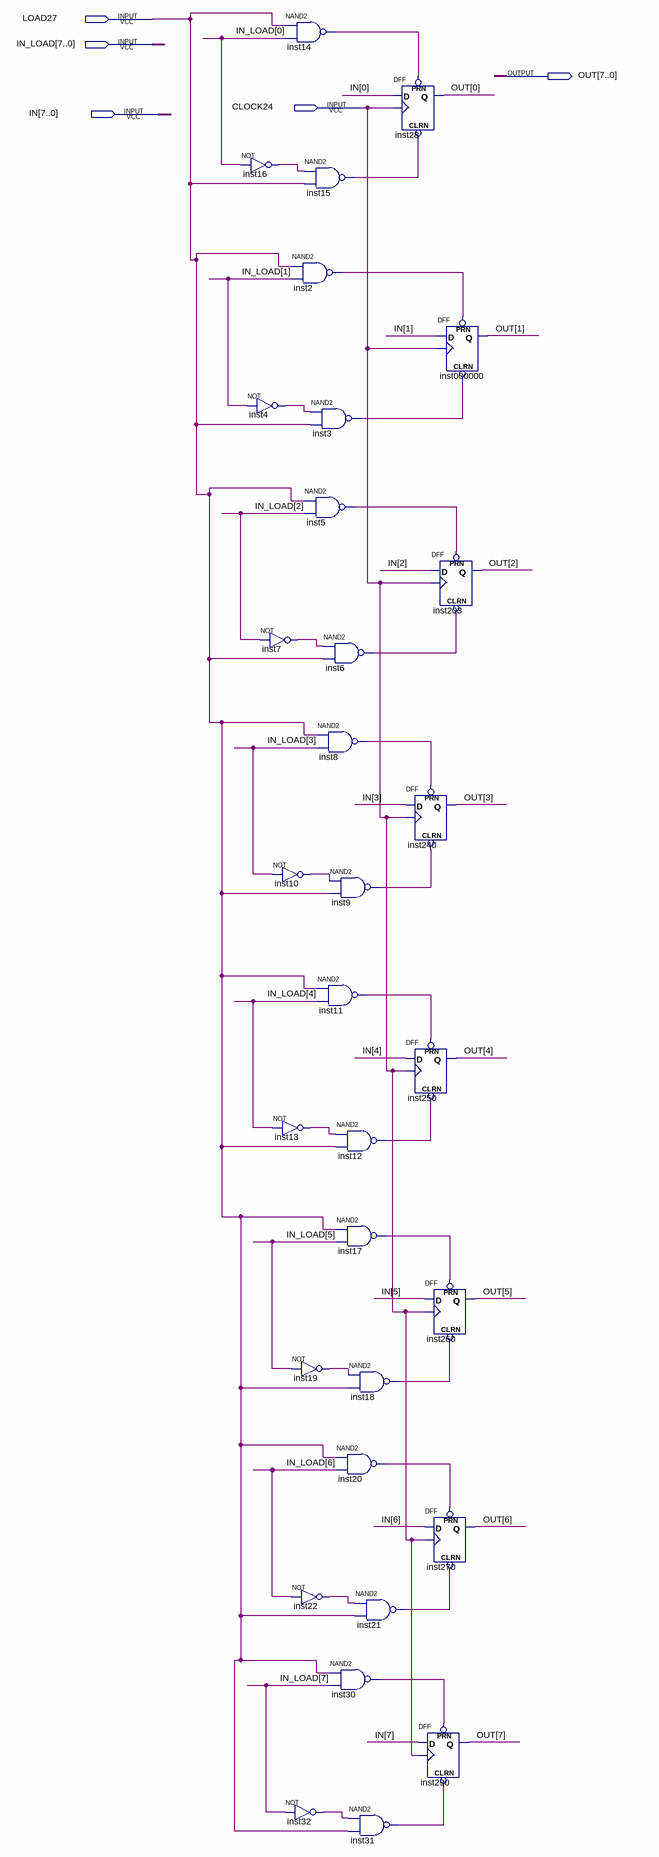
[diagram p0: schematic sheet]
// Quartus schematic REGISTER_8bit.bdf as structural Verilog: 32 symbols, 5 pins
module REGISTER_8bit (
  input  LOAD27,
  input  [7:0] IN_LOAD,
  input  CLOCK24,
  input  [7:0] IN,
  output [7:0] OUT
);

  wire inst2_out, inst3_out, inst4_out, inst5_out, inst6_out, inst7_out, inst8_out, inst9_out, inst10_out,
       inst11_out, inst12_out, inst13_out, inst14_out, inst15_out, inst16_out, inst17_out, inst18_out,
       inst19_out, inst20_out, inst21_out, inst22_out, inst30_out, inst31_out, inst32_out;

  not inst16 (inst16_out, IN_LOAD[0]);
  not inst4 (inst4_out, IN_LOAD[1]);
  nand inst14 (inst14_out, LOAD27, IN_LOAD[0]);
  nand inst2 (inst2_out, LOAD27, IN_LOAD[1]);
  not inst7 (inst7_out, IN_LOAD[2]);
  not inst10 (inst10_out, IN_LOAD[3]);
  not inst13 (inst13_out, IN_LOAD[4]);
  not inst19 (inst19_out, IN_LOAD[5]);
  not inst22 (inst22_out, IN_LOAD[6]);
  not inst32 (inst32_out, IN_LOAD[7]);
  nand inst15 (inst15_out, inst16_out, LOAD27);
  nand inst3 (inst3_out, inst4_out, LOAD27);
  nand inst5 (inst5_out, LOAD27, IN_LOAD[2]);
  nand inst6 (inst6_out, inst7_out, LOAD27);
  nand inst8 (inst8_out, LOAD27, IN_LOAD[3]);
  nand inst9 (inst9_out, inst10_out, LOAD27);
  nand inst11 (inst11_out, LOAD27, IN_LOAD[4]);
  nand inst12 (inst12_out, inst13_out, LOAD27);
  nand inst17 (inst17_out, LOAD27, IN_LOAD[5]);
  nand inst18 (inst18_out, inst19_out, LOAD27);
  nand inst20 (inst20_out, LOAD27, IN_LOAD[6]);
  nand inst30 (inst30_out, LOAD27, IN_LOAD[7]);
  nand inst31 (inst31_out, inst32_out, LOAD27);
  DFF inst28 (.CLRN(inst15_out), .CLK(CLOCK24), .D(IN[0]), .PRN(inst14_out), .Q(OUT[0]));
  nand inst21 (inst21_out, inst22_out, LOAD27);
  DFF inst000000 (.CLRN(inst3_out), .CLK(CLOCK24), .D(IN[1]), .PRN(inst2_out), .Q(OUT[1]));
  DFF inst203 (.CLRN(inst6_out), .CLK(CLOCK24), .D(IN[2]), .PRN(inst5_out), .Q(OUT[2]));
  DFF inst240 (.CLRN(inst9_out), .CLK(CLOCK24), .D(IN[3]), .PRN(inst8_out), .Q(OUT[3]));
  DFF inst250 (.CLRN(inst12_out), .CLK(CLOCK24), .D(IN[4]), .PRN(inst11_out), .Q(OUT[4]));
  DFF inst260 (.CLRN(inst18_out), .CLK(CLOCK24), .D(IN[5]), .PRN(inst17_out), .Q(OUT[5]));
  DFF inst270 (.CLRN(inst21_out), .CLK(CLOCK24), .D(IN[6]), .PRN(inst20_out), .Q(OUT[6]));
  DFF inst290 (.CLRN(inst31_out), .CLK(CLOCK24), .D(IN[7]), .PRN(inst30_out), .Q(OUT[7]));
endmodule
